# EAGLE schematic Ifargan door lock (EAGLE 7.4.0)
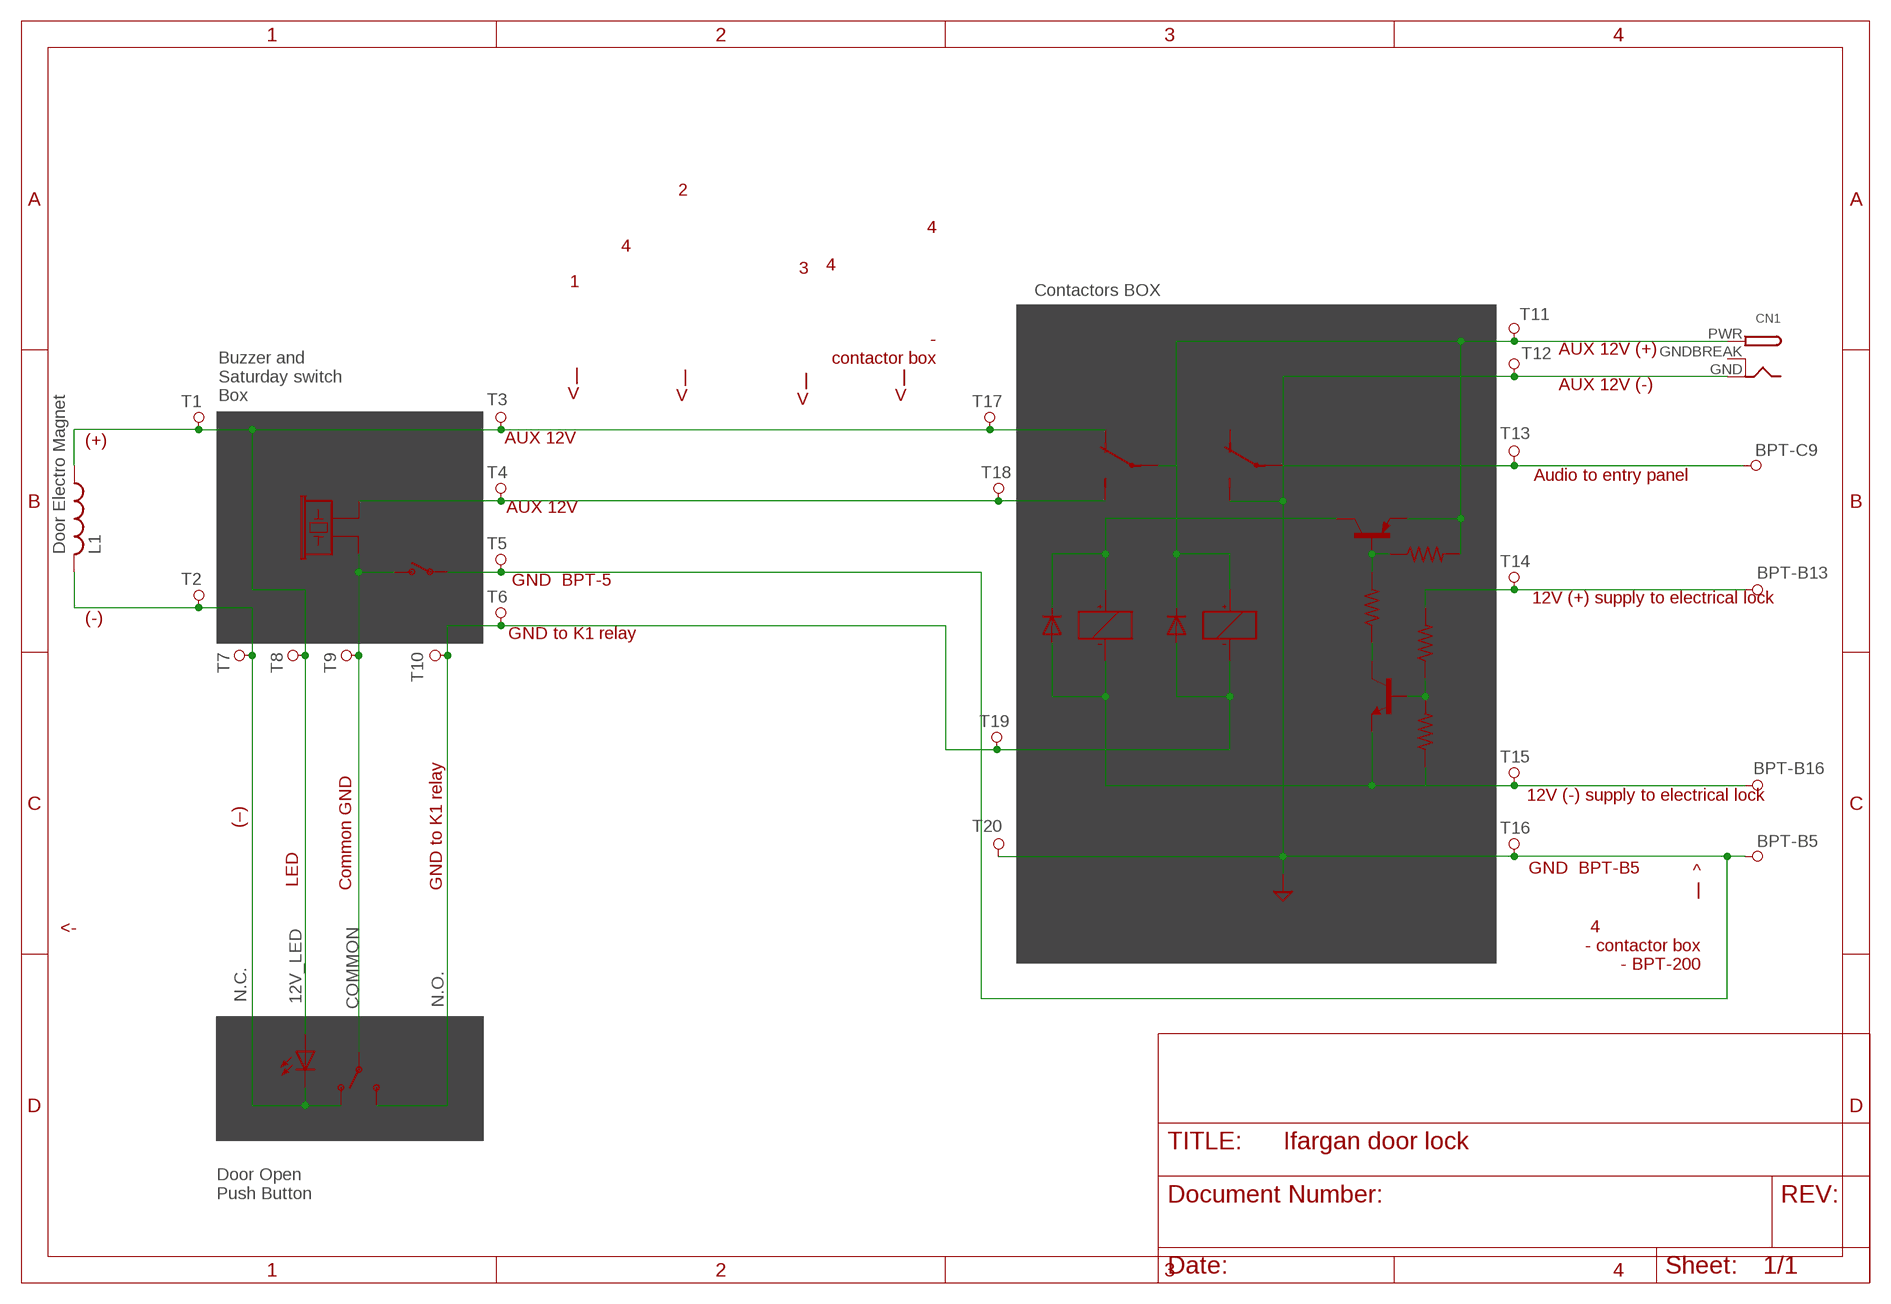
[diagram p0: schematic, sheet 1]

## Parts
BPT-B5  PAD_TERMINAL-4.1MMROUND  [PAD_ROUND_4.1MM]
BPT-B13  PAD_TERMINAL-4.1MMROUND  [PAD_ROUND_4.1MM]
BPT-B16  PAD_TERMINAL-4.1MMROUND  [PAD_ROUND_4.1MM]
BPT-C9  PAD_TERMINAL-4.1MMROUND  [PAD_ROUND_4.1MM]
CN1  DCBARRELPTH  [DCJACK_2MM_PTH]
D1  1N4004  [DO41-10]
D2  1N4004  [DO41-10]
K1  Relay  DS2Y-S-DC1.5V  [DS2Y]
K2  Relay  DS2Y-S-DC1.5V  [DS2Y]
L1  Door Electro Magnet  L-USIRF-3  [IRF-3]
LED1  LED  [SMARTLED-TTW]
Q1  2N2905  [TO5]
Q2  2N2219  [TO5]
R1  10K  R-US_0207/15  [0207/15]
R2  1K  R-US_0207/15  [0207/15]
R3  1K  R-US_0207/15  [0207/15]
R4  10K  R-US_0207/15  [0207/15]
S1  Door Open P.B.  SWITCH_SPDT  [KPS-1290]
S2  Saturday SW  SWITCH_SPST  [SPST_SMT_19192]
SG1  Buzzer  F/EE21P  [F/EE21P]
T1  PAD_TERMINAL-4.1MMROUND  [PAD_ROUND_4.1MM]
T2  PAD_TERMINAL-4.1MMROUND  [PAD_ROUND_4.1MM]
T3  PAD_TERMINAL-4.1MMROUND  [PAD_ROUND_4.1MM]
T4  PAD_TERMINAL-4.1MMROUND  [PAD_ROUND_4.1MM]
T5  PAD_TERMINAL-4.1MMROUND  [PAD_ROUND_4.1MM]
T6  PAD_TERMINAL-4.1MMROUND  [PAD_ROUND_4.1MM]
T7  PAD_TERMINAL-4.1MMROUND  [PAD_ROUND_4.1MM]
T8  PAD_TERMINAL-4.1MMROUND  [PAD_ROUND_4.1MM]
T9  PAD_TERMINAL-4.1MMROUND  [PAD_ROUND_4.1MM]
T10  PAD_TERMINAL-4.1MMROUND  [PAD_ROUND_4.1MM]
T11  PAD_TERMINAL-4.1MMROUND  [PAD_ROUND_4.1MM]
T12  PAD_TERMINAL-4.1MMROUND  [PAD_ROUND_4.1MM]
T13  PAD_TERMINAL-4.1MMROUND  [PAD_ROUND_4.1MM]
T14  PAD_TERMINAL-4.1MMROUND  [PAD_ROUND_4.1MM]
T15  PAD_TERMINAL-4.1MMROUND  [PAD_ROUND_4.1MM]
T16  PAD_TERMINAL-4.1MMROUND  [PAD_ROUND_4.1MM]
T17  PAD_TERMINAL-4.1MMROUND  [PAD_ROUND_4.1MM]
T18  PAD_TERMINAL-4.1MMROUND  [PAD_ROUND_4.1MM]
T19  PAD_TERMINAL-4.1MMROUND  [PAD_ROUND_4.1MM]
T20  PAD_TERMINAL-4.1MMROUND  [PAD_ROUND_4.1MM]

## Nets
12V_LED: K2.6(2:O) L1.1 LED1.A@1(A) T1.P T3.P T8.P T17.P
AUX-12V: CN1.PWR D2.C K1.1(1:+) K2.4(2:P) Q1.1(E) R1.2 T11.P
COMMON: S1.P S2.C(S) SG1.1 T9.P
GND: BPT-B5.P CN1.GND K1.8(2:S) S2.B(P) T5.P T12.P T16.P T20.P
N$1: Q2.2(B) R3.1 R4.2
N$2: Q1.2(B) R1.1 R2.2
N$4: BPT-B16.P D1.A K2.16(1:-) Q2.1(E) R4.1 T15.P
N$5: Q2.3(C) R2.1
N$6: BPT-B13.P R3.2 T14.P
N$7: BPT-C9.P K1.4(2:P)
N$8: K2.8(2:S) SG1.2 T4.P T18.P
N$9: D1.C K2.1(1:+) Q1.3(C)
N.C.: L1.2 LED1.C@1(C) S1.O T2.P T7.P
N.O.: D2.A K1.16(1:-) S1.S T6.P T10.P T19.P
Unconnected: K1.6(2:O) K1.9(3:S) K1.11(3:O) K1.13(3:P) K2.9(3:S) K2.11(3:O) K2.13(3:P) T13.P

## Notes on the sheet
- Contactors BOX
- אדום
- AUX 12V (+)
- שחור
- AUX 12V (-)
- מקטע 1
  צמה שטוחה
  מהמנעול העליון
  אל איזור 
  המנעול הישן
           |
           V
- Buzzer and
  Saturday switch
  Box
- מקטע 2
  כבל
  לבן
  4 גידי
  קצר
  מאיזור 
  המנעול
  הישן
  אל פנל
  הכניסה
     |
     V
- מקטע 4
  כבל לבן
  4 גידי קצר
  מגשר
  מהכבל
  הרב גידי
  אל ה-
  contactor box
   |      
   V
- מקטע 3
  כבל
  לבן
  רב גידי
  מפנל הכניסה
  אל ארון בזק
        |
        V
- אדום | ירוק | לבן | סגול | לבן
- AUX 12V מנעול
- לבן
- (+) מנעול
       מגנטי
- Audio to entry panel
- כחול | כתום | צהוב | כתום
- AUX 12V זמזם
- סגול | כחול | ירוק
- GND  BPT-5 | כתום
- שחור | 12V (+) supply to electrical lock
- אפור | לבן עם קשר | שחור | לבן עם קשר
- GND to K1 relay
- (-)מנעול
      מגנטי
- כחול
- 12V (-) supply to electrical lock
- לבן עם קשר
- GND  BPT-B5
- לחצן (–) למנעול מגנטי
- LED  לחצן | Common GND  לחצן | GND to K1 relay לחצן
- חום | אדום | כתום | צהוב
- צמה שטוחה
  <- מהמנעול המגנטי
      אל לחצן הפתיחה
- ^
     |
  כבל לבן
  4 גידי קצר
  מגשר מה- contactor box
  אל ה- BPT-200
- Door Open
  Push Button

## Power pins joined to a net without a drawn wire
GNDBREAK: CN1.GNDBREAK

## Library data of the parts
BPT-B5 BPT-B13 BPT-B16 BPT-C9 T1-T20 = dp_devices:PAD_TERMINAL: Terminal connection pad
CN1 = adafruit:DCBARREL: 2.0mm DC Barrel Jack DCJACK_2MM_PTH - Through Hole Jack (4UConnector: 05537)
D1 D2 = diode:1N4004: DIODE general purpose rectifier, 1 A
K1 K2 = relay:DS2Y-S-DC*: MINIATURE RELAY NAiS Source: http://www.mew-europe.com/.. en_ds_61005_0023.pdf; MPN: DS2Y-S-DC1.5V; OC_FARNELL: unknown; OC_NEWARK: 10C5827
L1 = rcl:L-US: INDUCTOR, American symbol
LED1 = adafruit:LED: LED OSRAM: - CHIPLED LG R971, LG N971, LY N971, LG Q971, LY Q971, LO R971, LY R971 LH N974, LH R974 LS Q976, LO Q976, LY Q976 LO Q996 - Hyper CHIPLED LW Q18S LB Q993, LB Q99A, LB R99A - SideLED LS A670, LO A670, LY A670, LG A670, LP A670 LB A673, LV A673, LT A673, LW A673 LH A674 LY A675 LS A676, LA A676, LO A676, LY A676, LW A676 LS A679, LY A679, LG A679 - Hyper Micro SIDELED® LS Y876, LA Y876, LO Y876, LY Y876 LT Y87S - SmartLED LW L88C, LW L88S LB L89C, LB L89S, LG L890 LS L89K, LO L89K, LY L89K LS L896, LA L896, LO L896, LY L896 - TOPLED LS T670, LO T670, LY T670, LG T670, LP T670 LSG T670, LSP T670, LSY T670, LOP T670, LYG T670 LG T671, LOG T671, LSG T671 LB T673, LV T673, LT T673, LW T673 LH T674 LS T676, LA T676, LO T676, LY T676, LB T676, LH T676, LSB T676, LW T676 LB T67C, LV T67C, LT T67C, LS T67K, LO T67K, LY T67K, LW E67C LS E67B, LA E67B, LO E67B, LY E67B, LB E67C, LV E67C, LT E67C LW T67C LS T679, LY T679, LG T679 LS T770, LO T770, LY T770, LG T770, LP T770 LB T773, LV T773, LT T773, LW T773 LH T774 LS E675, LA E675, LY E675, LS T675 LS T776, LA T776, LO T776, LY T776, LB T776 LHGB T686 LT T68C, LB T68C - Hyper Mini TOPLED® LB M676 - Mini TOPLED Santana® LG M470 LS M47K, LO M47K, LY M47K Source: http://www.osram.convergy.de/
Q1 = transistor-pnp:2N2905: PNP Transistor
Q2 = transistor:2N2219: NPN TRANSISTOR
R1-R4 = adafruit:R-US_: RESISTOR, American symbol
S1 = ATTiny Fuse Reset with 12V Charge Pump:SWITCH_SPDT: Side-actuated SPDT slide switch, as used on the Arduino Pro
S2 = microbuilder:SWITCH_SPST: Switch - SPST 4UCon 19192 (6.7x2.6mm SMT)
SG1 = buzzer:F/EE21P: BUZZER Source: Buerklin; OC_FARNELL: unknown; OC_NEWARK: unknown